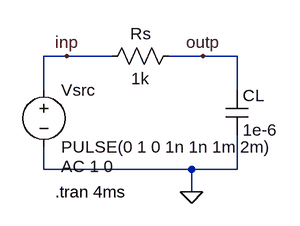
[diagram p0: schematic rc_ltspice0.asc]
rc_ltspice0.asc, the LTspice schematic file:
Version 4
SHEET 1 880 680
WIRE 80 96 48 96
WIRE 144 96 80 96
WIRE 272 96 224 96
WIRE 320 96 272 96
WIRE 48 144 48 96
WIRE 320 144 320 96
WIRE 48 256 48 224
WIRE 256 256 48 256
WIRE 320 256 320 208
WIRE 320 256 256 256
WIRE 256 288 256 256
FLAG 256 288 0
FLAG 80 96 inp
FLAG 272 96 outp
SYMBOL res 240 80 R90
WINDOW 0 0 56 VBottom 2
WINDOW 3 32 56 VTop 2
SYMATTR InstName Rs
SYMATTR Value 1k
SYMBOL cap 304 144 R0
SYMATTR InstName CL
SYMATTR Value 1e-6
SYMBOL voltage 48 128 R0
WINDOW 123 24 124 Left 2
WINDOW 39 0 0 Left 0
SYMATTR Value2 AC 1 0
SYMATTR InstName Vsrc
SYMATTR Value PULSE(0 1 0 1n 1n 1m 2m)
TEXT 64 288 Left 2 !.tran 4ms

The netlist it stands for:
* rc_ltspice0.asc
Rs outp inp 1k
CL outp 0 1e-6
Vsrc inp 0 PULSE(0 1 0 1n 1n 1m 2m) AC 1 0
.tran 4ms
.backanno
.end

* Results of the author's LTspice run, read from the files saved beside the schematic
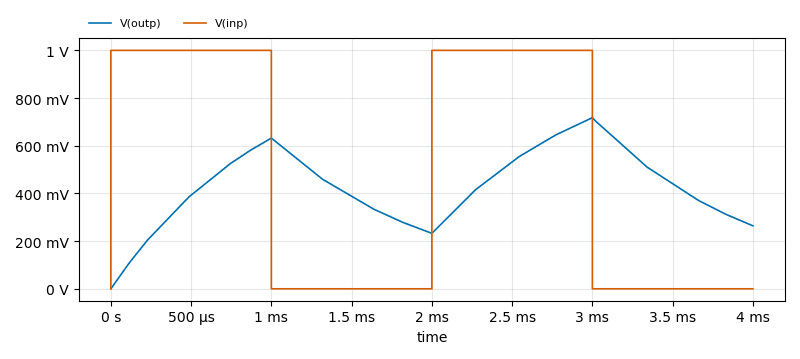
[diagram p1: Transient Analysis of rc_ltspice0.asc, plotted from the saved traces]
* Transient Analysis, 1 run:
*   V(outp): min 0 V, max 717.7 mV, average 434.3 mV, rms 464 mV, last 264 mV
*   V(inp): min 0 V, max 1 V, average 500 mV, rms 707.1 mV, last 0 V